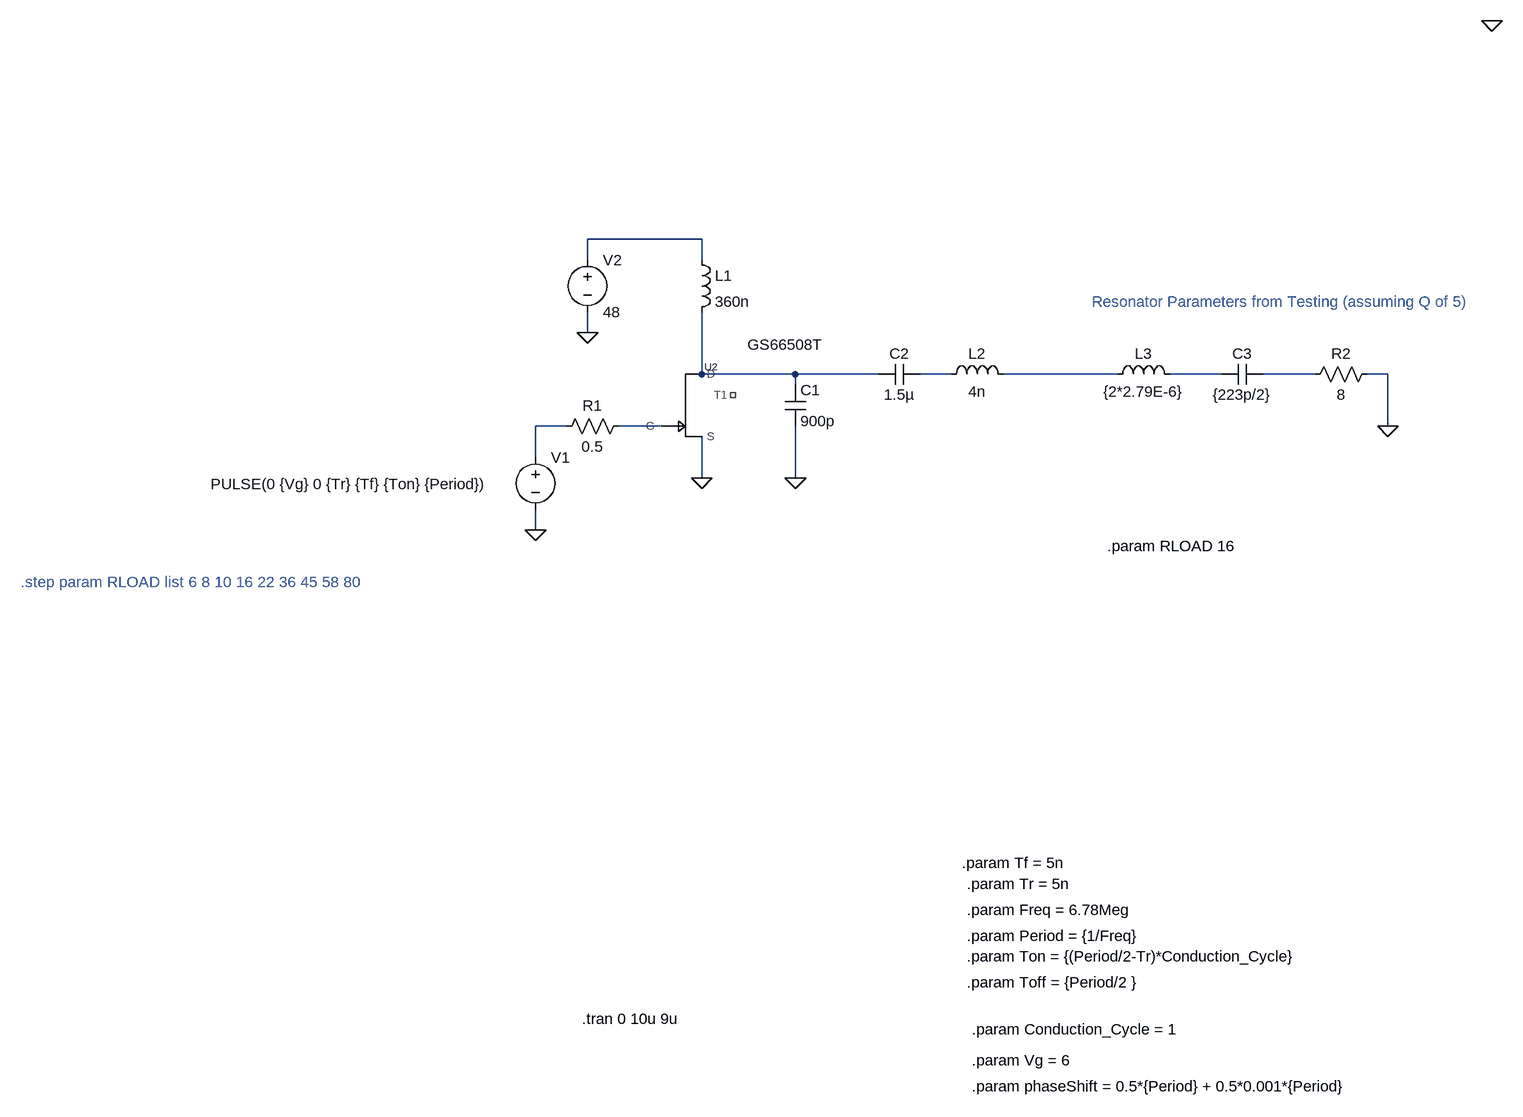
[diagram p0: schematic class_E_modified.asc]
class_E_modified.asc, the LTspice schematic file:
Version 4
SHEET 1 900 776
WIRE -400 -544 -576 -544
WIRE -576 -512 -576 -544
WIRE -400 -512 -400 -544
WIRE -576 -400 -576 -432
WIRE -400 -336 -400 -432
WIRE -256 -336 -400 -336
WIRE -128 -336 -256 -336
WIRE -16 -336 -64 -336
WIRE 240 -336 64 -336
WIRE 400 -336 320 -336
WIRE 544 -336 464 -336
WIRE 656 -336 624 -336
WIRE -256 -320 -256 -336
WIRE -608 -256 -656 -256
WIRE -464 -256 -528 -256
WIRE 656 -256 656 -336
WIRE -656 -208 -656 -256
WIRE -400 -176 -400 -240
WIRE -256 -176 -256 -256
WIRE -656 -96 -656 -128
FLAG -400 -176 0
FLAG -256 -176 0
FLAG -656 -96 0
FLAG -576 -400 0
FLAG 816 -880 0
FLAG 656 -256 0
SYMBOL voltage -656 -224 R0
WINDOW 3 -500 57 Left 2
WINDOW 123 0 0 Left 2
WINDOW 39 0 0 Left 2
SYMATTR Value PULSE(0 {Vg} 0 {Tr} {Tf} {Ton} {Period})
SYMATTR InstName V1
SYMBOL GaN_E-HEMT_LT_GS66508T -448 -288 R0
SYMATTR InstName U2
SYMBOL ind -416 -528 R0
SYMATTR InstName L1
SYMATTR Value 360n
SYMBOL res -512 -272 R90
WINDOW 0 0 56 VBottom 2
WINDOW 3 32 56 VTop 2
SYMATTR InstName R1
SYMATTR Value 0.5
SYMBOL cap -272 -320 R0
SYMATTR InstName C1
SYMATTR Value 900p
SYMBOL cap -64 -352 R90
WINDOW 0 0 32 VBottom 2
WINDOW 3 32 32 VTop 2
SYMATTR InstName C2
SYMATTR Value 1.5µ
SYMBOL ind -32 -320 R270
WINDOW 0 32 56 VTop 2
WINDOW 3 5 56 VBottom 2
SYMATTR InstName L2
SYMATTR Value 4n
SYMBOL voltage -576 -528 R0
WINDOW 123 0 0 Left 2
WINDOW 39 0 0 Left 2
SYMATTR InstName V2
SYMATTR Value 48
SYMBOL ind 224 -320 R270
WINDOW 0 32 56 VTop 2
WINDOW 3 5 56 VBottom 2
SYMATTR InstName L3
SYMATTR Value {2*2.79E-6}
SYMBOL cap 464 -352 R90
WINDOW 0 0 32 VBottom 2
WINDOW 3 32 32 VTop 2
SYMATTR InstName C3
SYMATTR Value {223p/2}
SYMBOL res 640 -352 R90
WINDOW 0 0 56 VBottom 2
WINDOW 3 32 56 VTop 2
SYMATTR InstName R2
SYMATTR Value 8
TEXT 0 416 Left 2 !.param Tf = 5n
TEXT 8 448 Left 2 !.param Tr = 5n
TEXT 8 488 Left 2 !.param Freq = 6.78Meg
TEXT 8 528 Left 2 !.param Period = {1/Freq}
TEXT 8 560 Left 2 !.param Ton = {(Period/2-Tr)*Conduction_Cycle}
TEXT 8 600 Left 2 !.param Toff = {Period/2 }
TEXT -584 656 Left 2 !.tran 0 10u 9u
TEXT 16 672 Left 2 !.param Conduction_Cycle = 1
TEXT 16 720 Left 2 !.param Vg = 6
TEXT -1448 -16 Left 2 ;.step param RLOAD list 6 8 10 16 22 36 45 58 80
TEXT 224 -72 Left 2 !.param RLOAD 16
TEXT 16 760 Left 2 !.param phaseShift = 0.5*{Period} + 0.5*0.001*{Period}
TEXT 200 -448 Left 2 ;Resonator Parameters from Testing (assuming Q of 5)

The netlist it stands for:
* class_E_modified.asc
V1 N007 0 PULSE(0 {Vg} 0 {Tr} {Tf} {Ton} {Period})
XU2 N008 N002 0 NC_01 GS66508T  ; pins G D S T1
L1 N001 N002 360n
R1 N008 N007 0.5
C1 N002 0 900p
C2 N003 N002 1.5µ
L2 N003 N004 4n
V2 N001 0 48
L3 N004 N005 {2*2.79E-6}
C3 N006 N005 {223p/2}
R2 0 N006 8
.param Tf = 5n
.param Tr = 5n
.param Freq = 6.78Meg
.param Period = {1/Freq}
.param Ton = {(Period/2-Tr)*Conduction_Cycle}
.param Toff = {Period/2 }
.tran 0 10u 9u
.param Conduction_Cycle = 1
.param Vg = 6
* .step param RLOAD list 6 8 10 16 22 36 45 58 80
.param RLOAD 16
.param phaseShift = 0.5*{Period} + 0.5*0.001*{Period}
* Resonator Parameters from Testing (assuming Q of 5)
.lib GaN_LTspice_GS66508T_Release1p27.lib
.backanno
.end